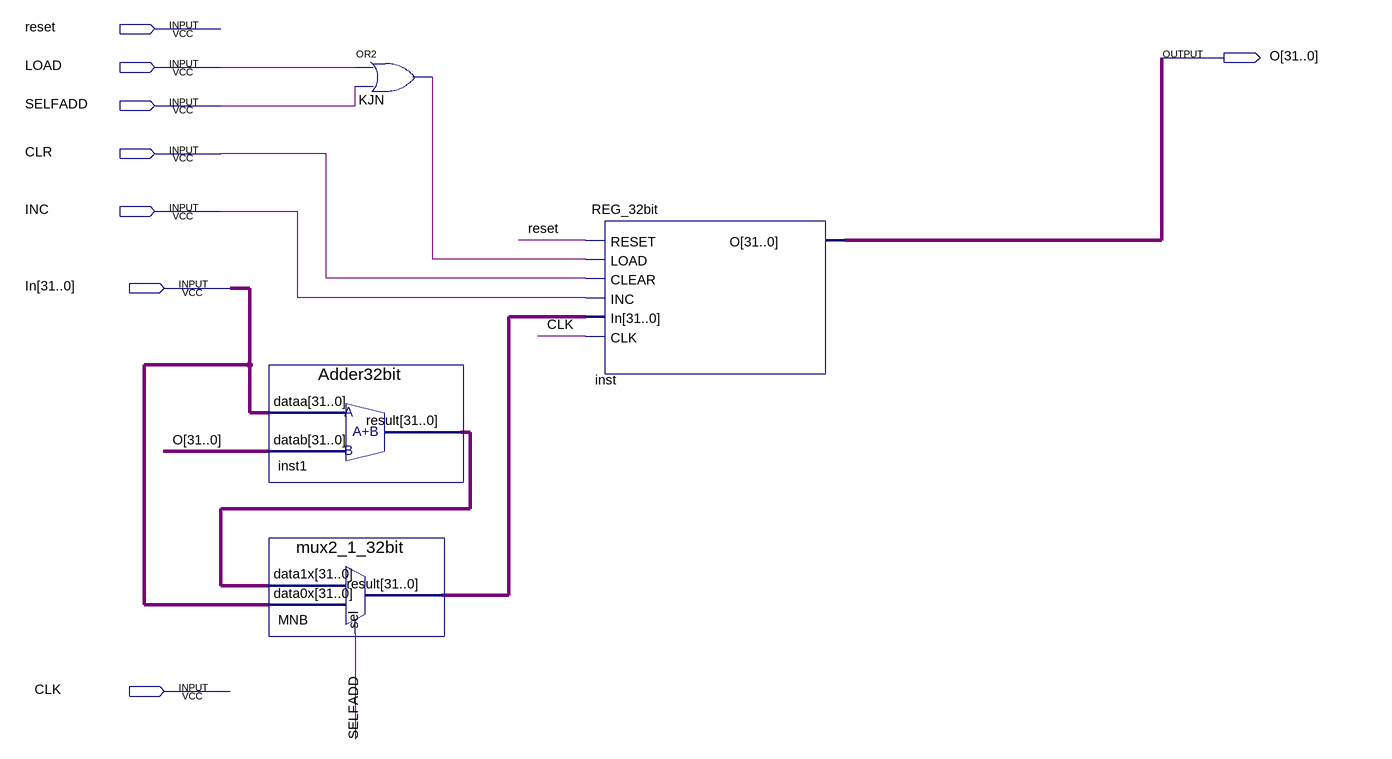
[diagram p0: schematic sheet]
// Quartus schematic PC.bdf as structural Verilog: 4 symbols, 8 pins
module PC (
  input  reset,
  input  LOAD,
  input  SELFADD,
  input  CLR,
  input  INC,
  input  [31:0] In,
  input  CLK,
  output [31:0] O
);

  wire KJN_out;
  wire [31:0] inst1_result, MNB_result;

  Adder32bit inst1 (.dataa(In), .datab(O), .result(inst1_result));
  mux2_1_32bit MNB (.data1x(inst1_result), .data0x(In), .sel(SELFADD), .result(MNB_result));
  or KJN (KJN_out, LOAD, SELFADD);
  REG_32bit inst (.RESET(reset), .LOAD(KJN_out), .CLEAR(CLR), .INC(INC), .In(MNB_result), .CLK(CLK), .O(O));
endmodule
